# EAGLE design midterm (EAGLE 7.6.0)
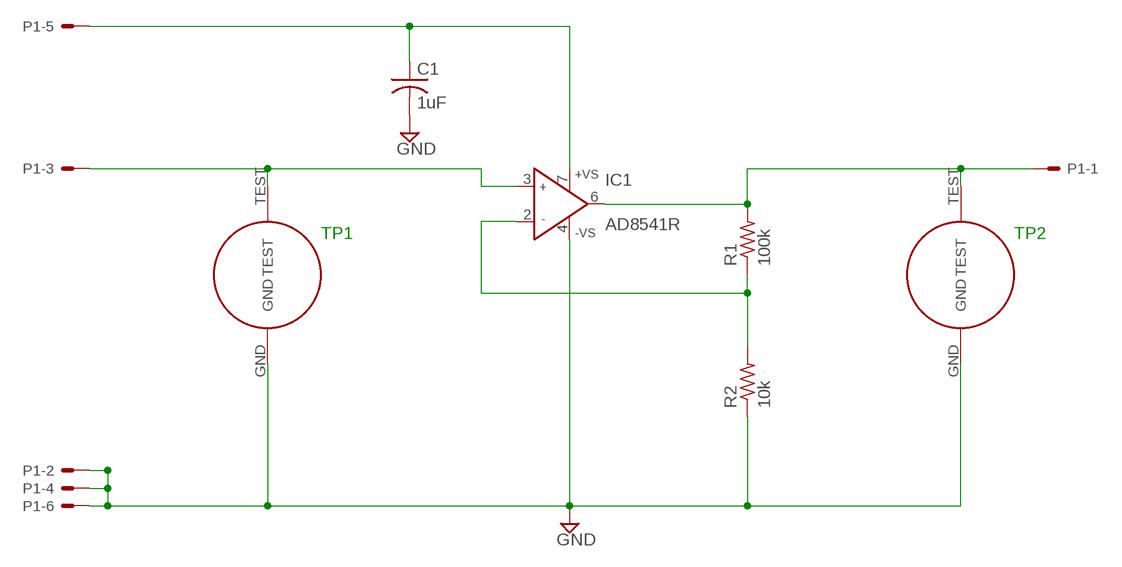
[diagram p0: schematic, sheet 1]

## Parts
C1  1uF  C-USC1206  [C1206]
IC1  AD8541R  [SO8]
P1  22-23-2061  [22-23-2061]
R1  100k  R-US_M2012  [M2012]
R2  10k  R-US_M2012  [M2012]
TP1  TEST_POINT  [TEST_POINT]
TP2  TEST_POINT  [TEST_POINT]

## Nets
GND: C1.2 IC1.4(-VS) P1.2 P1.4 P1.6 R2.1 TP1.GND TP2.GND
N$1: C1.1 IC1.7(+VS) P1.5
N$2: IC1.3(IN+) P1.3 TP1.TEST
N$3: IC1.2(IN-) R1.1 R2.2
N$4: IC1.6(OUT) P1.1 R1.2 TP2.TEST

## Notes on the sheet
- TP1 | TP2

## Library data of the parts
C1 = resistor:C-US: CAPACITOR, American symbol
IC1 = analog-devices:AD8541: General-Purpose CMOS Rail-to-Rail Amplifiers Source: http://www.analog.com/static/imported-files/data_sheets/AD8541_8542_8544.pdf; MPN: AD8541ARZ; OC_FARNELL: 9603859; OC_NEWARK: 31M4547
P1 = con-molex:22-23-2061: .100" (2.54mm) Center Header - 6 Pin; MF: MOLEX; MPN: 22-23-2061; OC_FARNELL: 1462922; OC_NEWARK: 27C1933
R1 R2 = rcl:R-US_: RESISTOR, American symbol
TP1 TP2 = TEST_POINT:TEST_POINT

## Board
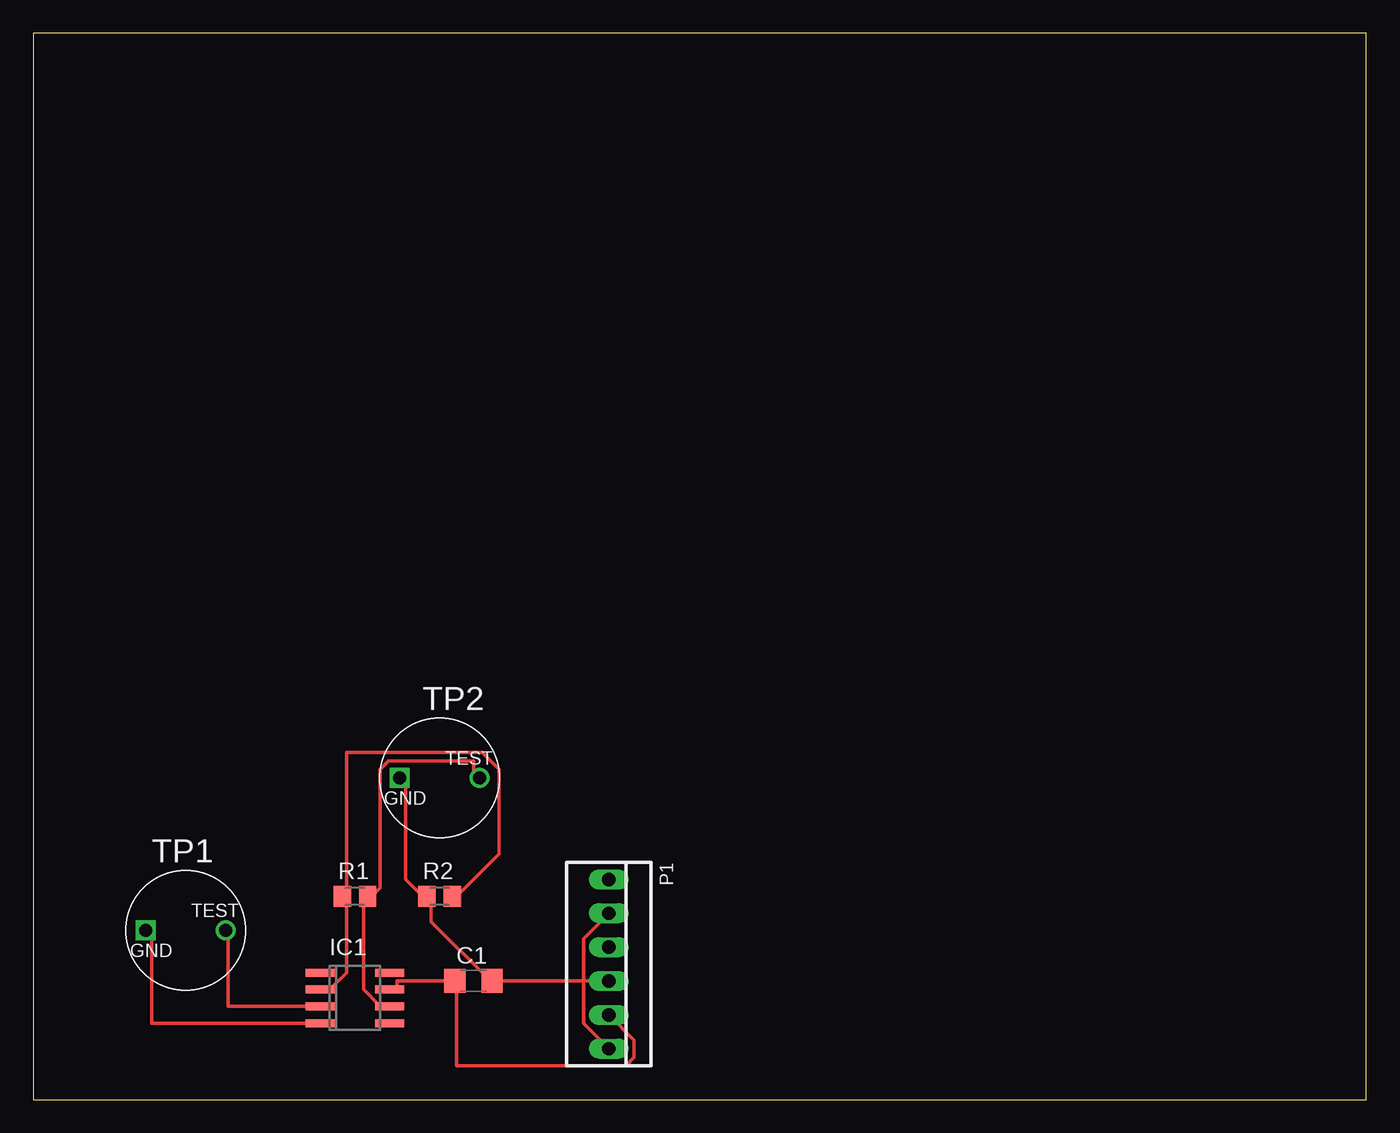
[diagram p1: board, top side]
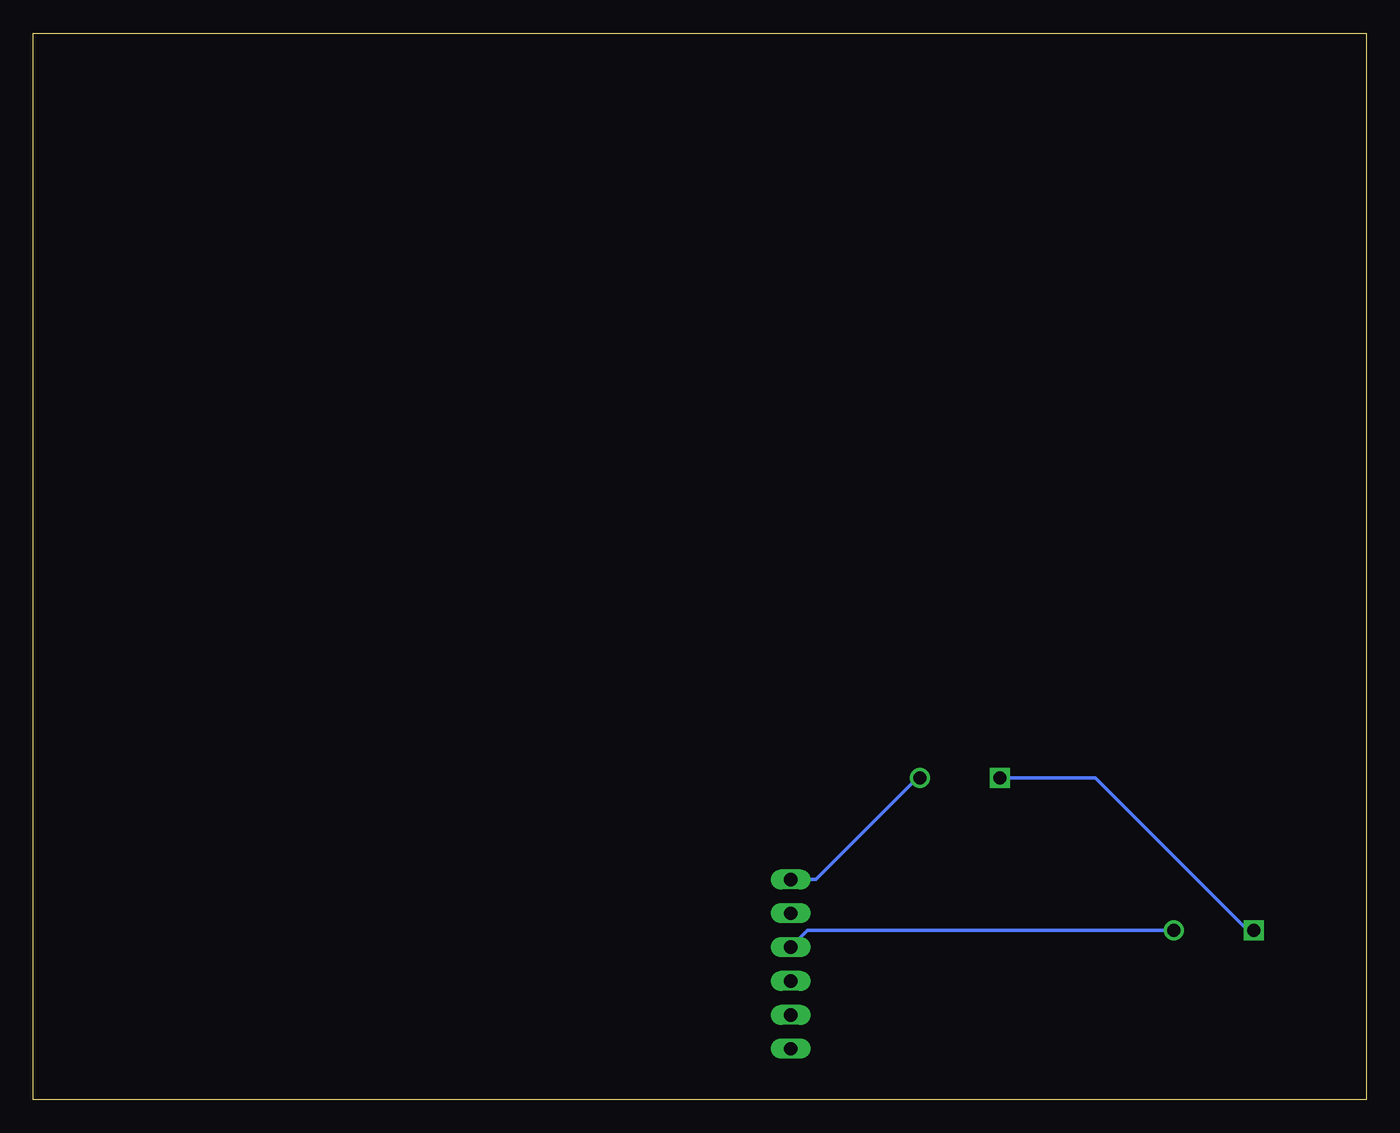
[diagram p2: board, bottom side, seen from below]

Size 100 x 80 mm. Coordinates in mm from the lower left corner, seen from the top.
Outline: 0,0 100,0 100,80 0,80 0,0
Copper layers (1*16): Top 0.035mm / dielectric 1.5mm / Bottom 0.035mm
Design rules "default": minimum track width 10mil, minimum drill 24mil, track to track 8mil, track to pad 8mil, pad to pad 8mil, via to via 8mil, smd to smd 8mil, copper to edge 40mil, drill to drill 8mil, minimum pad ring 10mil, minimum via ring 8mil, stop-mask expansion 4mil, vias tented up to drill 0mil, thermal gap 10mil

### Footprints (pad centres in the part's own frame; a part is rotated, then mirrored left to right if it is on the bottom)
C1206 = smd 1.6 x 1.8: 1 -1.4,0; 2 1.4,0
SO8 = smd 0.6 x 2.2: 1 -1.905,-2.6; 2 -0.635,-2.6; 3 0.635,-2.6; 4 1.905,-2.6; 5 1.905,2.6; 6 0.635,2.6; 7 -0.635,2.6; 8 -1.905,2.6
22-23-2061 = drill 1 long: 1 -6.35,0; 2 -3.81,0; 3 -1.27,0; 4 1.27,0; 5 3.81,0; 6 6.35,0
M2012 = smd 1.3 x 1.6: 1 -0.95,0; 2 0.95,0
TEST_POINT = drill 1 square: GND 3,0 | drill 1: TEST -3,0

### Placement (x,y rotation side)
C1  33.02,8.89 0 top
IC1  24.13,7.62 270 top
P1  43.18,10.16 270 top
R1  24.13,15.24 0 top
R2  30.48,15.24 0 top
TP1  11.43,12.7 180 top
TP2  30.48,24.13 180 top

### Tracks (layer width: path | path; a pad name or v marks a point on that pad's centre or on a via)
GND
  Top 0.254: IC1.4 8.89,5.71 8.89,12.7 TP1.GND | TP2.GND 27.94,24.13 27.94,16.51 29.21,15.24 R2.1 29.84,15.24 29.84,13.34 34.29,8.89 C1.2 41.27,8.89 | P1.4 41.27,8.89 | P1.6 41.27,5.71 41.27,8.89 | P1.2 41.27,12.06 41.27,8.89
  Bottom 0.254: TP2.GND 20.32,24.13 8.89,12.7 TP1.GND
N$1
  Top 0.254: IC1.7 27.3,8.26 27.3,8.89 C1.1 31.75,8.89 31.75,2.54 44.45,2.54 45.09,3.17 45.09,4.45 P1.5
N$2
  Top 0.254: IC1.3 14.61,6.99 14.61,12.7 TP1.TEST
  Bottom 0.254: P1.3 41.91,12.7 TP1.TEST
N$3
  Top 0.254: 23.5,15.24 23.5,9.53 22.23,8.26 IC1.2 | 23.5,15.24 23.5,26.04 33.66,26.04 34.92,24.77 34.92,18.41 31.75,15.24 R2.2 | 23.5,15.24 R1.1
N$4
  Top 0.254: IC1.6 26.04,6.99 24.77,8.26 24.77,15.24 R1.2 25.4,15.24 26.04,15.88 26.04,24.77 26.67,25.4 33.02,25.4 33.02,24.13 TP2.TEST
  Bottom 0.254: P1.1 41.27,16.51 33.66,24.13 TP2.TEST

### Text on the board
tNames: TP2 | TP1